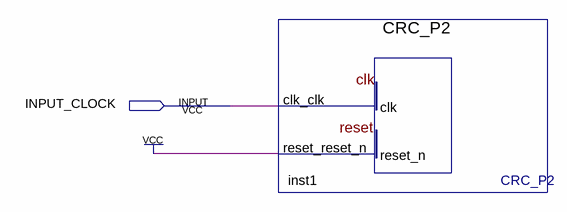
[diagram p0: schematic sheet]
// Quartus schematic TopLevelP2.bdf as structural Verilog: 1 symbols, 1 pins
module TopLevelP2 (
  input  INPUT_CLOCK
);

  CRC_P2 inst1 (.clk_clk(INPUT_CLOCK), .reset_reset_n(1'b1));
endmodule
